# EAGLE schematic Battery_tester (EAGLE 7.7.0)
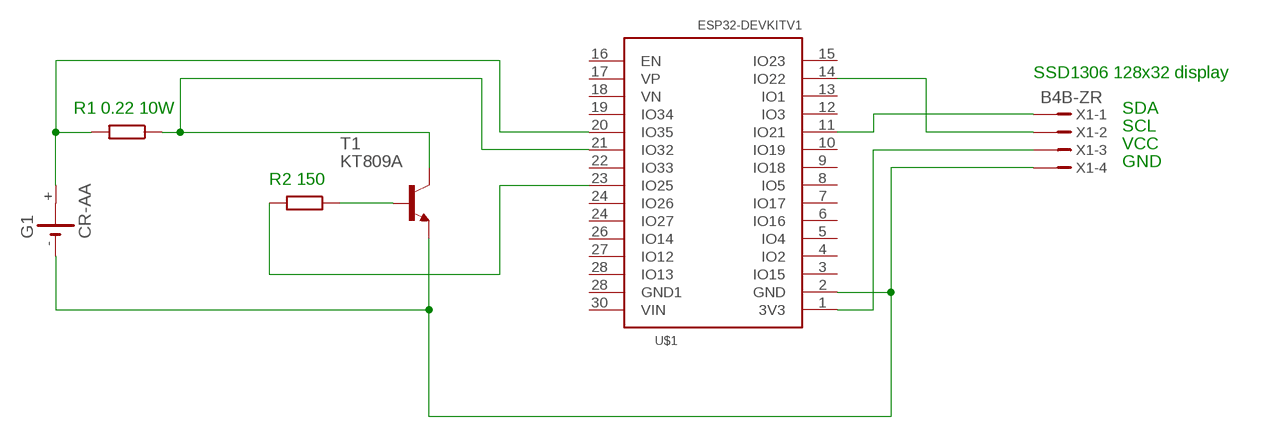
[diagram p0: schematic, sheet 1]
R1 (R): R1: 0.22
R2 (R): R2: 150

## Parts
G1  CR-AA  [CRAA]
T1  KT809A  -NPN-TO3/  [TO3]
U$1  ESP32DEVKITV1  [ESP32-DEVKITV1]
X1  B4B-ZR  [B4B-ZR]

## Nets
N$4: T1.B
N$5: U$1.23(IO25)
N$6: G1.- T1.E U$1.2(GND) X1.4
N$7: U$1.1(3V3) X1.3
N$8: U$1.14(IO22) X1.2
N$9: U$1.11(IO21) X1.1
N$10: G1.+ U$1.20(IO35)
N$11: T1.C U$1.21(IO32)
Unconnected: G1.+@1(+) U$1.3(IO15) U$1.4(IO2) U$1.5(IO4) U$1.6(IO16) U$1.7(IO17) U$1.8(IO5) U$1.9(IO18) U$1.10(IO19) U$1.12(IO3) U$1.13(IO1) U$1.15(IO23) U$1.16(EN) U$1.17(VP) U$1.18(VN) U$1.19(IO34) U$1.22(IO33) U$1.24(IO26) U$1.24(IO27) U$1.26(IO14) U$1.27(IO12) U$1.28(GND1) U$1.28(IO13) U$1.30(VIN)

## Notes on the sheet
- SSD1306 128x32 display
- R1 0.22 10W | SDA
- SCL
- VCC
- GND
- R2 150

## Library data of the parts
G1 = battery:CR-AA: LI BATTERY Varta CRAA-SLF
T1 = transistor:*-NPN-: NPN Transistror BF959 corrected 2008.03.06
U$1 = ESP32-DEVKITV1:ESP32DEVKITV1
X1 = con-jst:?4B-ZR: ZH CONNECTOR 1.5 mm, 4 pin 1 row Source: http://www.jst.com .. eZH.pdf; MF: FARNELL; MPN: B4B-ZR(LF)(SN); OC_FARNELL: 1830916; OC_NEWARK: 37K9960